# EAGLE design esp8285_v01 (EAGLE 7.6.0)
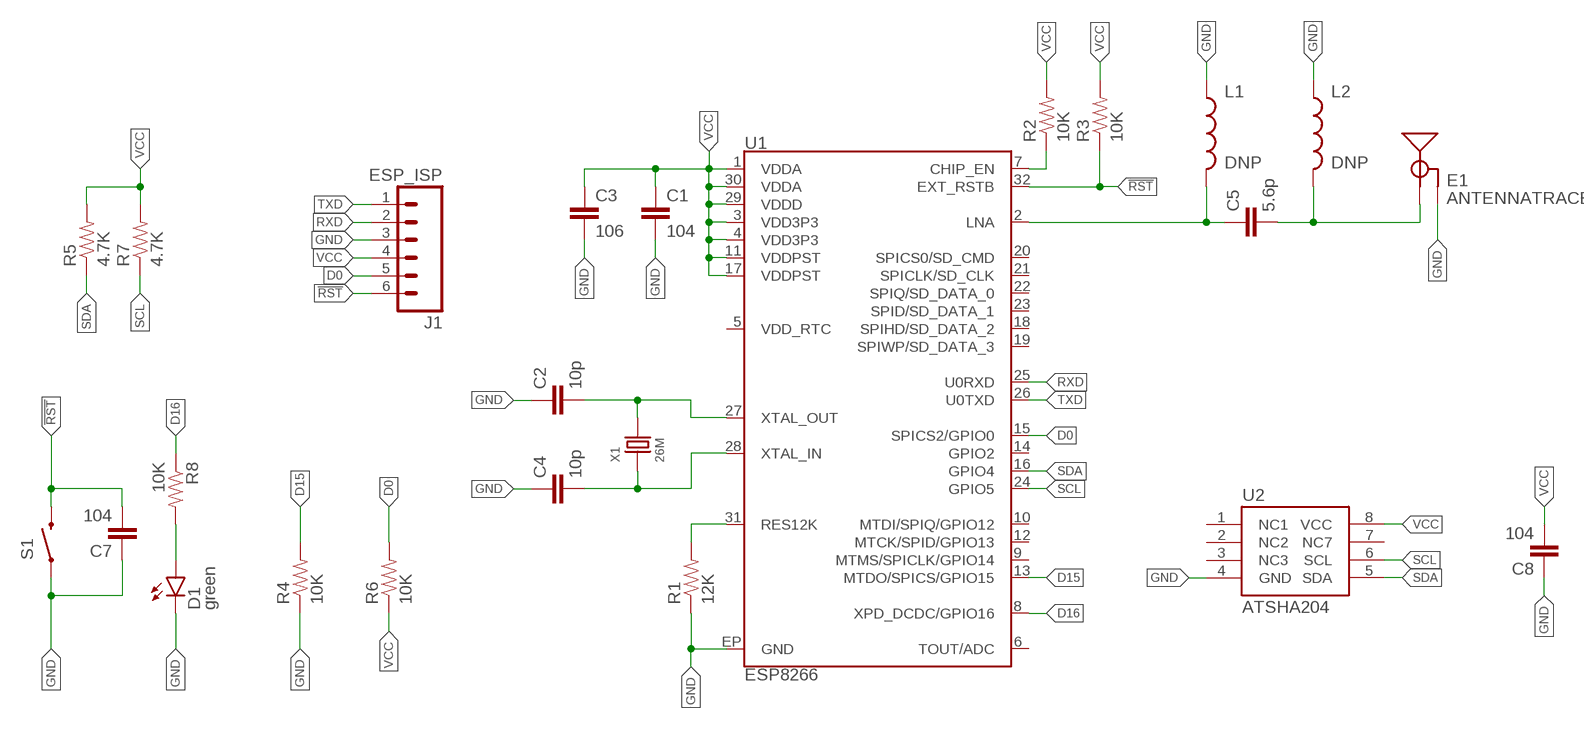
[diagram p0: schematic, sheet 1]

## Parts
C1  104  CAP0402-CAP  [0402-CAP]
C2  10p  CAP0402-CAP  [0402-CAP]
C3  106  CAP0402-CAP  [0402-CAP]
C4  10p  CAP0402-CAP  [0402-CAP]
C5  5.6p  CAP0402-CAP  [0402-CAP]
C7  104  CAP0402-CAP  [0402-CAP]
C8  104  CAP0402-CAP  [0402-CAP]
D1  green  LED-EASY  [LED-0603-EASY]
E1  ANTENNATRACE  [TRACE_ANTENNA_2.4GHZ_25.7MM]
J1  ESP_ISP  M06NO_SILK_FEMALE_PTH  [1X06_NO_SILK]
L1  DNP  INDUCTOR0402  [C0402]
L2  DNP  INDUCTOR0402  [C0402]
R1  12K  RESISTOR0402  [0402-RES]
R2  10K  RESISTOR0402  [0402-RES]
R3  10K  RESISTOR0402  [0402-RES]
R4  10K  RESISTOR0402  [0402-RES]
R5  4.7K  RESISTOR0402  [0402-RES]
R6  10K  RESISTOR0402  [0402-RES]
R7  4.7K  RESISTOR0402  [0402-RES]
R8  10K  RESISTOR0402  [0402-RES]
S1  SWITCH-MOMENTARY-2SMD-1101NE  [TACTILE-SWITCH-1101NE]
U1  ESP8266  [QFN32]
U2  ATSHA204  ATSHA204_SOIC8  [SO08]
X1  26M  CRYSTAL'3225'  [X4-SMD-3.2X2.5X0.7MM]

## Nets
!RST: C7.2 J1.6 R3.1 S1.2 U1.32(EXT_RSTB)
D0: J1.5 R6.2 U1.15(SPICS2/GPIO0)
D15: R4.2 U1.13(MTDO/SPICS/GPIO15)
D16: R8.1 U1.8(XPD_DCDC/GPIO16)
GND: C1.2 C2.1 C3.2 C4.1 C7.1 C8.1 D1.-(C) E1.GND E1.GND2(GND) J1.3 L1.1 L2.1 R1.1 R4.1 S1.1 U1.EP(GND) U2.4(GND)
N$1: C2.2 U1.27(XTAL_OUT) X1.3
N$2: C4.2 U1.28(XTAL_IN) X1.1
N$3: R1.2 U1.31(RES12K)
N$4: C5.1 L1.2 U1.2(LNA)
N$5: C5.2 E1.ANT(SIGNAL) L2.2
N$6: R2.1 U1.7(CHIP_EN)
N$7: D1.+(A) R8.2
RXD: J1.2 U1.25(U0RXD)
SCL: R7.1 U1.24(GPIO5) U2.6(SCL)
SDA: R5.1 U1.16(GPIO4) U2.5(SDA)
TXD: J1.1 U1.26(U0TXD)
VCC: C1.1 C3.1 C8.2 J1.4 R2.2 R3.2 R5.2 R6.1 R7.2 U1.1(VDDA) U1.3(VDD3P3) U1.4(VDD3P3) U1.11(VDDPST) U1.17(VDDPST) U1.29(VDDD) U1.30(VDDA) U2.8(VCC)
Unconnected: U1.5(VDD_RTC) U1.6(TOUT/ADC) U1.9(MTMS/SPICLK/GPIO14) U1.10(MTDI/SPIQ/GPIO12) U1.12(MTCK/SPID/GPIO13) U1.14(GPIO2) U1.18(SPIHD/SD_DATA_2) U1.19(SPIWP/SD_DATA_3) U1.20(SPICS0/SD_CMD) U1.21(SPICLK/SD_CLK) U1.22(SPIQ/SD_DATA_0) U1.23(SPID/SD_DATA_1) U2.1(NC1) U2.2(NC2) U2.3(NC3) U2.7(NC7)

## Library data of the parts
C1-C5 C7 C8 = z_jlc_smt:CAP: Capacitor Standard 0603 ceramic capacitor, and 0.1" leaded capacitor.
D1 = z_jlc_smt:LED: LEDs Standard schematic elements and footprints for 5mm, 3mm, 1206, and 0603 sized LEDs. 5mm - Spark Fun Electronics SKU : COM-00529 (and others)
E1 = SparkFun-RF:ANTENNA: Chip antenna Chip antenna with ground or secondary connection. Common with larger metal RF connectors.
J1 = SparkFun-Connectors:M06: Header 6 Standard 6-pin 0.1" header. Use with straight break away headers (SKU : PRT-00116), right angle break away headers (PRT-00553), swiss pins (PRT-00743), machine pins (PRT-00117), and female headers (PRT-00115). Molex polarized connector foot print use with SKU : PRT-08094 with associated crimp pins and housings. NOTES ON THE VARIANTS LOCK and LOCK_LONGPADS... This footprint was designed to help hold the alignment of a through-hole component (i.e. 6-pin header) while soldering it into place. You may notice that each hole has been shifted either up or down by 0.005 of an inch from it's more standard position (which is a perfectly straight line). This slight alteration caused the pins (the squares in the middle) to touch the edges of the holes. Because they are alternating, it causes a "brace" to hold the component in place. 0.005 has proven to be the perfect amount of "off-center" position when using our standard breakaway headers. Although looks a little odd when you look at the bare footprint, once you have a header in there, the alteration is very hard to notice. Also,if you push a header all the way into place, it is covered up entirely on the bottom side. This idea of altering the position of holes to aid alignment will be further integrated into the Sparkfun Library for other footprints. It can help hold any component with 3 or more connection pins.; PROD_ID: CONN-08437
L1 L2 = SparkFun-Passives:INDUCTOR: Inductors Basic Inductor/Choke - 0603 and 1206. Footprints are not proven and vary greatly between part numbers. INDUCTOR POWER 3.3UH 4.0A SMD 0.197" L x 0.197" W x 0.177" H (5.00mm x 5.00mm x 4.50mm)
R1-R8 = z_jlc_smt:RESISTOR: Resistor Basic schematic elements and footprints for 0603, 1206, and PTH resistors.
S1 = xmgu2008:SWITCH-MOMENTARY-2: Various NO switches- pushbuttons, reed, etc; PROD_ID: SWCH-00815
U1 = SparkFun-RF:ESP8266: Espressif ESP8266 WiFi Smart Connectivity Platform.; PROD_ID: IC-12452
U2 = SparkFun-IC-Special-Function:ATSHA204_SOIC8: Crypto 4.5KB I2C Datasheet <https://cdn.sparkfun.com/datasheets/Dev/Beagle/Atmel-8740-CryptoAuth-ATSHA204-Datasheet.pdf> SparkFun Products CryptoCape <https://www.sparkfun.com/products/12773> (DEV-12773) SparkFun CryptoShield <https://www.sparkfun.com/products/13183> (DEV-13183); PROD_ID: IC-11981
X1 = Seeed-OPL-Crystal-Oscillator:CRYSTAL

## Board
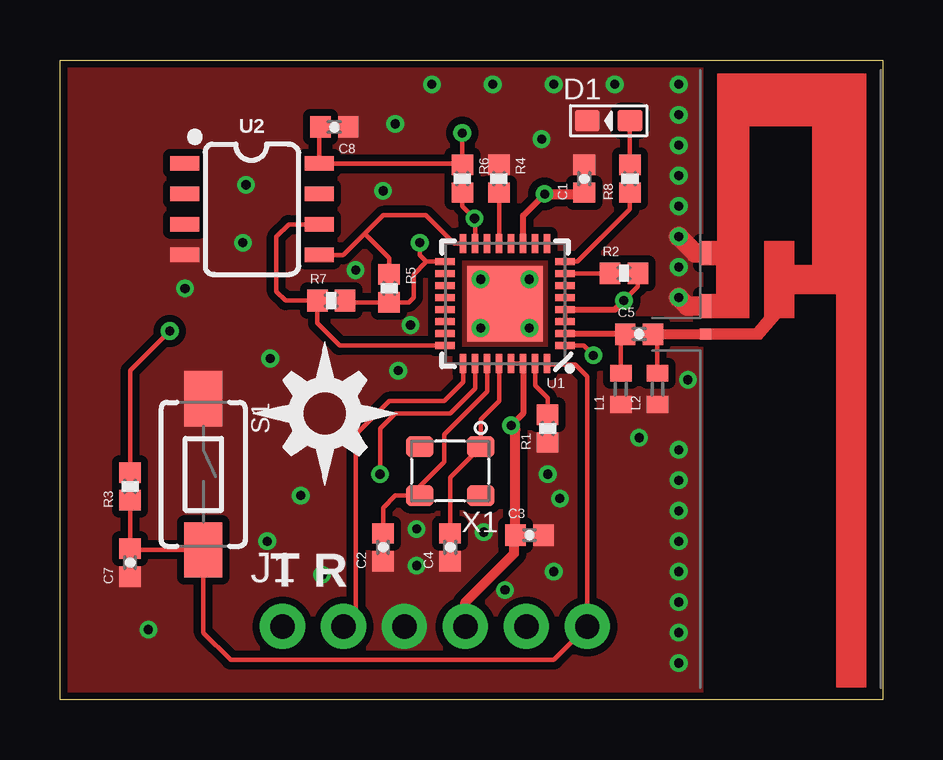
[diagram p1: board, top side]
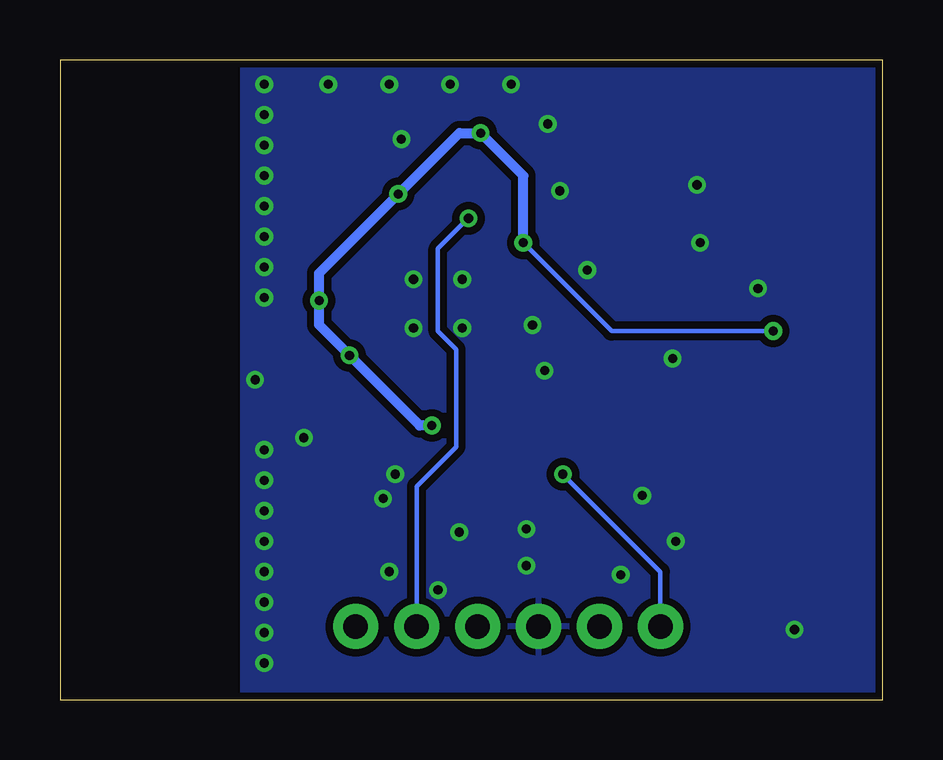
[diagram p2: board, bottom side, seen from below]

Size 34.29 x 26.67 mm. Coordinates in mm from the lower left corner, seen from the top.
Outline: 0,0 0,26.67 34.29,26.67 34.29,0 0,0
Copper layers (1*16): Top 0.035mm / dielectric 1.5mm / Bottom 0.035mm
Design rules "SparkFun-2-layer-TIGHT": minimum track width 7mil, minimum drill 15mil, track to track 7mil, track to pad 7mil, pad to pad 7mil, via to via 7mil, smd to smd 7mil, copper to edge 7mil, drill to drill 7mil, minimum pad ring 7mil, minimum via ring 7mil, stop-mask expansion 4mil, vias tented up to drill 20mil, thermal gap 10mil

### Footprints (pad centres in the part's own frame; a part is rotated, then mirrored left to right if it is on the bottom)
0402-CAP = smd 0.85 x 0.9: 1 -0.58,0; 2 0.58,0
LED-0603-EASY = smd 1.016 x 0.889: + 0.889,0; - -0.889,0
TRACE_ANTENNA_2.4GHZ_25.7MM = smd 0.46 x 0.46: ANT 0,0.23 | smd 1 x 0.46: GND -1.18,0.23; GND2 -3.38,0.23
1X06_NO_SILK = drill 1.016 pad 1.88: 1 0,0; 2 2.54,0; 3 5.08,0; 4 7.62,0; 5 10.16,0; 6 12.7,0
C0402 = smd 0.7 x 0.9: 1 -0.65,0; 2 0.65,0
0402-RES = smd 0.85 x 0.9: 1 -0.58,0; 2 0.58,0
TACTILE-SWITCH-1101NE = smd 2.3 x 1.6: 1 -3.15,0; 2 3.15,0
QFN32 = smd 0.8 x 0.285: 1 -2.5,1.75; 2 -2.5,1.25; 3 -2.5,0.75; 4 -2.5,0.25; 5 -2.5,-0.25; 6 -2.5,-0.75; 7 -2.5,-1.25; 8 -2.5,-1.75; 17 2.5,-1.75; 18 2.5,-1.25; 19 2.5,-0.75; 20 2.5,-0.25; 21 2.5,0.25; 22 2.5,0.75; 23 2.5,1.25; 24 2.5,1.75 | smd 0.285 x 0.8: 9 -1.75,-2.5; 10 -1.25,-2.5; 11 -0.75,-2.5; 12 -0.25,-2.5; 13 0.25,-2.5; 14 0.75,-2.5; 15 1.25,-2.5; 16 1.75,-2.5; 25 1.75,2.5; 26 1.25,2.5; 27 0.75,2.5; 28 0.25,2.5; 29 -0.25,2.5; 30 -0.75,2.5; 31 -1.25,2.5; 32 -1.75,2.5 | smd 3.15 x 3.15: EP 0,0
SO08 = smd 0.6 x 1.2: 1 -1.905,-2.8; 2 -0.635,-2.8; 3 0.635,-2.8; 4 1.905,-2.8; 5 1.905,2.8; 6 0.635,2.8; 7 -0.635,2.8; 8 -1.905,2.8
X4-SMD-3.2X2.5X0.7MM = smd 1.143 x 0.889: 1 -1.27,-1.016; 2 1.27,-1.016; 3 1.27,1.016; 4 -1.27,1.016

### Placement (x,y rotation side)
C1  21.84,21.72 90 top
C2  13.46,6.35 90 top
C3  19.56,6.86 0 top
C4  16.26,6.35 90 top
C5  24.13,15.24 0 top
C7  2.92,5.71 90 top
C8  11.43,23.88 180 top
D1  22.86,24.13 0 top
E1  26.67,15.24 270 top
J1  9.27,3.05 0 top
L1  23.37,12.95 90 top
L2  24.89,12.95 90 top
R1  20.32,11.3 90 top
R2  23.5,17.78 0 top
R3  2.92,8.89 90 top
R4  18.29,21.72 270 top
R5  13.72,17.14 270 top
R6  16.76,21.72 270 top
R7  11.3,16.64 0 top
R8  23.75,21.72 90 top
S1  5.97,9.4 270 top
U1  18.54,16.51 180 top
U2  8,20.45 270 top
U$1  [DIYNOVA_LOGO]  8,8.89 0 top
X1  16.26,9.53 180 top

### Tracks (layer width: path | path; a pad name or v marks a point on that pad's centre or on a via)
!RST
  Top 0.178: U1.32 20.33,13.97 21.46,13.97 21.97,13.46 J1.6 20.57,1.65 7.11,1.65 5.97,2.79 S1.2 2.97,6.25 C7.2 R3.1
D0  (via drill 0.38)
  Top 0.178: R6.2 16.76,20.57 v17.27,20.07 17.29,20.05 U1.15
  Bottom 0.178: 17.29,20.05 v17.27,20.07 18.54,18.8 18.54,15.37 17.78,14.61 17.78,10.54 19.43,8.89 J1.5
D15
  Top 0.178: U1.13 R4.2
D16
  Top 0.178: U1.8 21.56,18.26 23.75,20.45 R8.1
GND  (via drill 0.38)
  Top 0.178: U1.EP v19.56,15.49
  Top 0.813: E1.GND2 26.46,18.62 v25.78,19.3 | E1.GND 26.12,16.42 v25.78,16.76
  other vias: 20.07,23.37 20.57,25.65 15.49,25.65 7.62,19.05 7.75,21.46 24.13,10.92 17.53,17.53 20.32,9.4 10.92,5.21 8.76,14.22 14.1,13.72 19.56,17.53 20.57,5.33 20.83,8.38 14.86,5.59 13.97,24 5.21,17.14 3.68,2.92 13.46,21.21 18.03,25.65 23.11,25.65 14.61,15.62 10.03,8.51 25.78,25.65 25.78,24.38 25.78,23.11 25.78,21.84 25.78,20.57 25.78,18.03 25.78,10.41 25.78,9.14 25.78,7.87 25.78,6.6 25.78,5.33 25.78,4.06 25.78,2.79 25.78,1.52 14.86,7.11 18.54,4.57 17.53,15.49 8.64,6.6 12.32,17.91 17.65,6.99 26.16,13.34
  pour Top (isolate 0.305, no thermals): 0,0 0,26.67 26.67,26.67 26.67,0
  pour Bottom (isolate 0.305): 0,0 0,26.67 26.67,26.67 26.67,0
N$1
  Top 0.178: U1.27 17.79,12.84 16,11.05 16,9.91 14.99,8.89 X1.3 13.97,8.51 13.46,8 C2.2
N$2
  Top 0.178: U1.28 18.29,12.45 17.53,11.68 X1.1 16.26,9.27 C4.2
N$3
  Top 0.178: U1.31 19.79,13.1 20.32,12.57 R1.2
N$4
  Top 0.178: L1.2 23.37,15.06 C5.1
  Top 0.254: U1.2 23.53,15.26 C5.1
N$5
  Top 0.178: L2.2 24.89,15.06 C5.2
  Top 0.406: C5.2 E1.ANT
N$6
  Top 0.178: U1.7 22.89,17.76 R2.1
N$7
  Top 0.178: R8.2 D1.+
RXD
  Top 0.178: U1.25 16.79,13.24 16,12.45 13.72,12.45 12.32,11.05 12.32,3.56 J1.2
SCL
  Top 0.178: U1.24 11.66,14.76 10.72,15.69 R7.1 9.4,16.64 9.02,17.02 9.02,19.3 9.53,19.81 U2.6
SDA
  Top 0.178: U1.16 16.42,19.01 15.24,20.19 13.46,20.19 12.7,19.43 | 12.7,19.43 11.81,18.54 U2.5 | R5.1 13.72,18.41 12.7,19.43
TXD  (via drill 0.38)
  Top 0.178: U1.26 17.29,12.97 16.26,11.94 13.97,11.94 13.34,11.3 v13.34,9.4
  Bottom 0.178: J1.1 9.27,5.33 v13.34,9.4
VCC  (via drill 0.38)
  Top 0.178: R2.2 24.07,17.22 v23.5,16.64 | U1.4 U1.3 | U1.1 21.82,14.76 v22.23,14.35 | U1.29 U1.30 | v16.76,23.62 R6.1 16.71,22.35 U2.8 10.8,23.83 C8.2 | U1.17 15.27,18.26 | 15.27,18.26 14.99,18.54 v14.99,19.05 | R7.2 11.96,16.57 R5.2 14.53,16.57 14.73,16.76 14.73,17.72 15.27,18.26 | R3.2 2.92,13.72 v4.57,15.37
  Top 0.254: U1.30 19.29,11.93 v18.8,11.43 | U1.4 23.12,16.26 v23.5,16.64 | U1.11 19.29,20.18 v20.19,21.08
  Top 0.406: J1.4 16.89,4.06 18.92,6.1 18.92,6.8 C3.1 18.98,11.25 v18.8,11.43 | v20.19,21.08 21.79,21.08 C1.1
  Bottom 0.178: v14.99,19.05 11.3,15.37 v4.57,15.37
  Bottom 0.406: v18.8,11.43 19.3,11.43 v22.23,14.35 23.5,15.62 v23.5,16.64 23.5,17.78 v20.19,21.08 17.65,23.62 v16.76,23.62 14.99,21.84 v14.99,19.05

### Text on the board
tPlace: T R